# EAGLE schematic mfrhp (EAGLE 7.7.0)
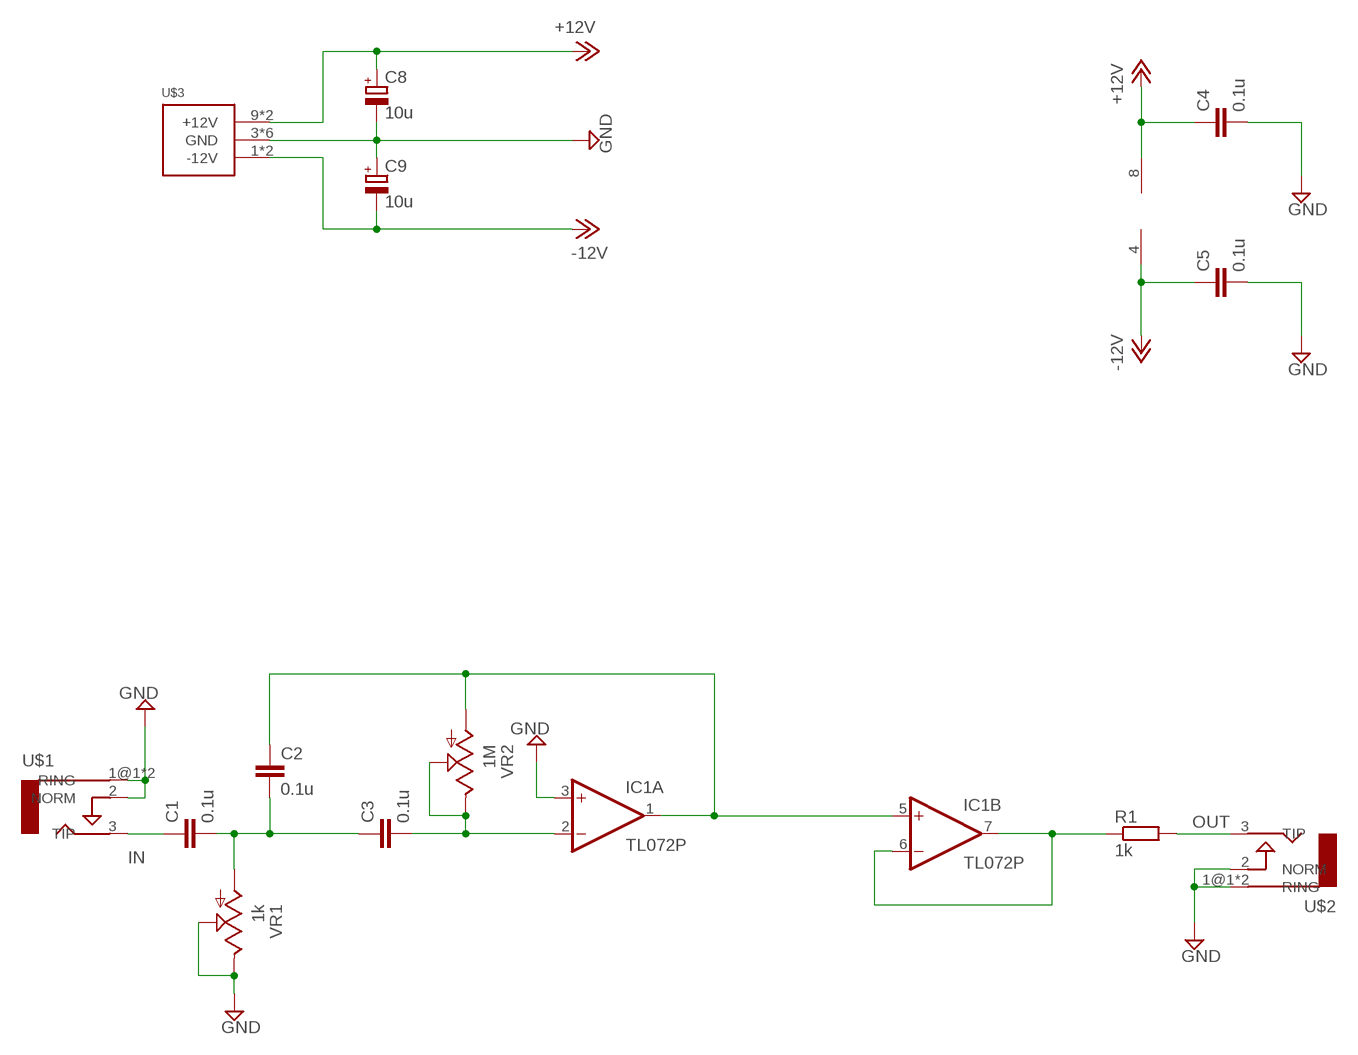
[diagram p0: schematic, sheet 1]

## Parts
C1  0.1u  C-EU050-025X075  [C050-025X075]
C2  0.1u  C-EU050-025X075  [C050-025X075]
C3  0.1u  C-EU050-025X075  [C050-025X075]
C4  0.1u  C-EU025-025X050  [C025-025X050]
C5  0.1u  C-EU025-025X050  [C025-025X050]
C8  10u  CPOL-EUE2.5-5  [E2,5-5]
C9  10u  CPOL-EUE2.5-5  [E2,5-5]
IC1  TL072P  [DIL08]
R1  1k  R-EU_0207/2V  [0207/2V]
U$1  AUDIO-JACKERTHENVAR  [ERTHENVAR-JACK]
U$2  AUDIO-JACKERTHENVAR  [ERTHENVAR-JACK]
U$3  POWER_SIMPLE10  [POWER_10]
VR1  1k  9MM_SNAP-IN_POT_  [9MM_SNAP-IN_POT]
VR2  1M  9MM_SNAP-IN_POT_  [9MM_SNAP-IN_POT]

## Nets
+12V: C4.1 C8.+ IC1.8(P:V+) U$3.9(+12V) U$3.10(+12V)
-12V: C5.1 C9.- IC1.4(P:V-) U$3.1(-12V) U$3.2(-12V)
GND: C4.2 C5.2 C8.- C9.+ IC1.3(A:+IN) U$1.1@1(RING) U$1.1@2(RING) U$1.2(NORM) U$2.1@1(RING) U$2.1@2(RING) U$2.2(NORM) U$3.3(GND) U$3.4(GND) U$3.5(GND) U$3.6(GND) U$3.7(GND) U$3.8(GND) VR1.2(S) VR1.3(E)
IN: C1.1 U$1.3(TIP)
N$2: C3.2 IC1.2(A:-IN) VR2.2(S) VR2.3(E)
N$3: C1.2 C2.2 C3.1 VR1.1(A)
N$6: IC1.6(B:-IN) IC1.7(B:OUT) R1.1
N$9: C2.1 IC1.1(A:OUT) IC1.5(B:+IN) VR2.1(A)
OUT: R1.2 U$2.3(TIP)

## Library data of the parts
C1-C5 = rcl:C-EU: CAPACITOR, European symbol
C8 C9 = rcl:CPOL-EU: POLARIZED CAPACITOR, European symbol
IC1 = linear:TL072: OP AMP
R1 = rcl:R-EU_: RESISTOR, European symbol
U$1 U$2 = erthenvar:AUDIO-JACK: Switching Mono 3.5mm Audio Jack from Erthenvar.
U$3 = eurorack:POWER_SIMPLE
VR1 VR2 = MusicThingModular:9MM_SNAP-IN_POT: 9mm vertical snap-in pot, Alpha / Panasonic style